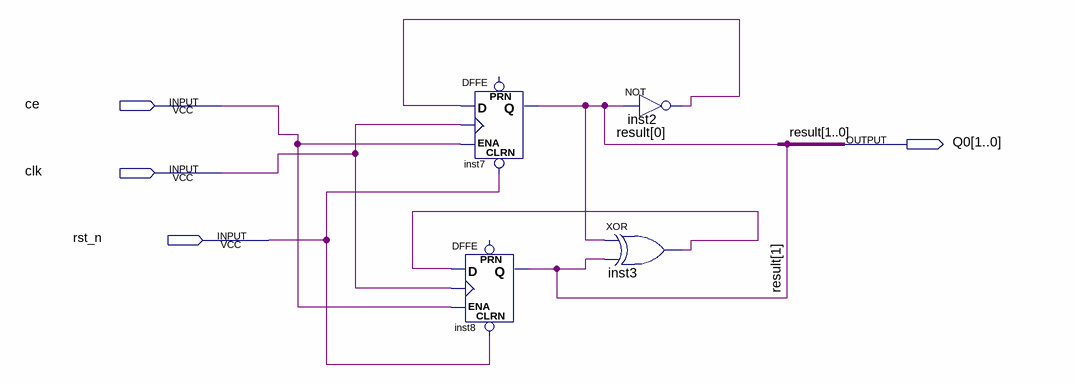
[diagram p0: schematic sheet]
// Quartus schematic symbol2.bdf as structural Verilog: 4 symbols, 4 pins
module symbol2 (
  input  ce,
  input  clk,
  input  rst_n,
  output [1:0] Q0
);

  wire inst2_out, inst3_out;

  DFFE inst7 (.CLRN(rst_n), .D(inst2_out), .CLK(clk), .ENA(ce), .Q(Q0[0]));  // open: PRN
  DFFE inst8 (.CLRN(rst_n), .D(inst3_out), .CLK(clk), .ENA(ce), .Q(Q0[1]));  // open: PRN
  not inst2 (inst2_out, Q0[0]);
  xor inst3 (inst3_out, Q0[0], Q0[1]);

  // Other names for the same wires on the sheet: result[1:0] = Q0
endmodule
